# Altium schematic sheet MAZ000162 - Diagrama eléctrico.SchDoc: MAZ000162 - Diagrama eléctrico
size A; ApprovedBy: Christian Ledwidth; CheckedBy: Nahuel Martinez; Author: Santiago Marti; CompanyName: Body Health; DrawnBy: Santiago Marti; Revision: A; SheetNumber: 1; SheetTotal: 2
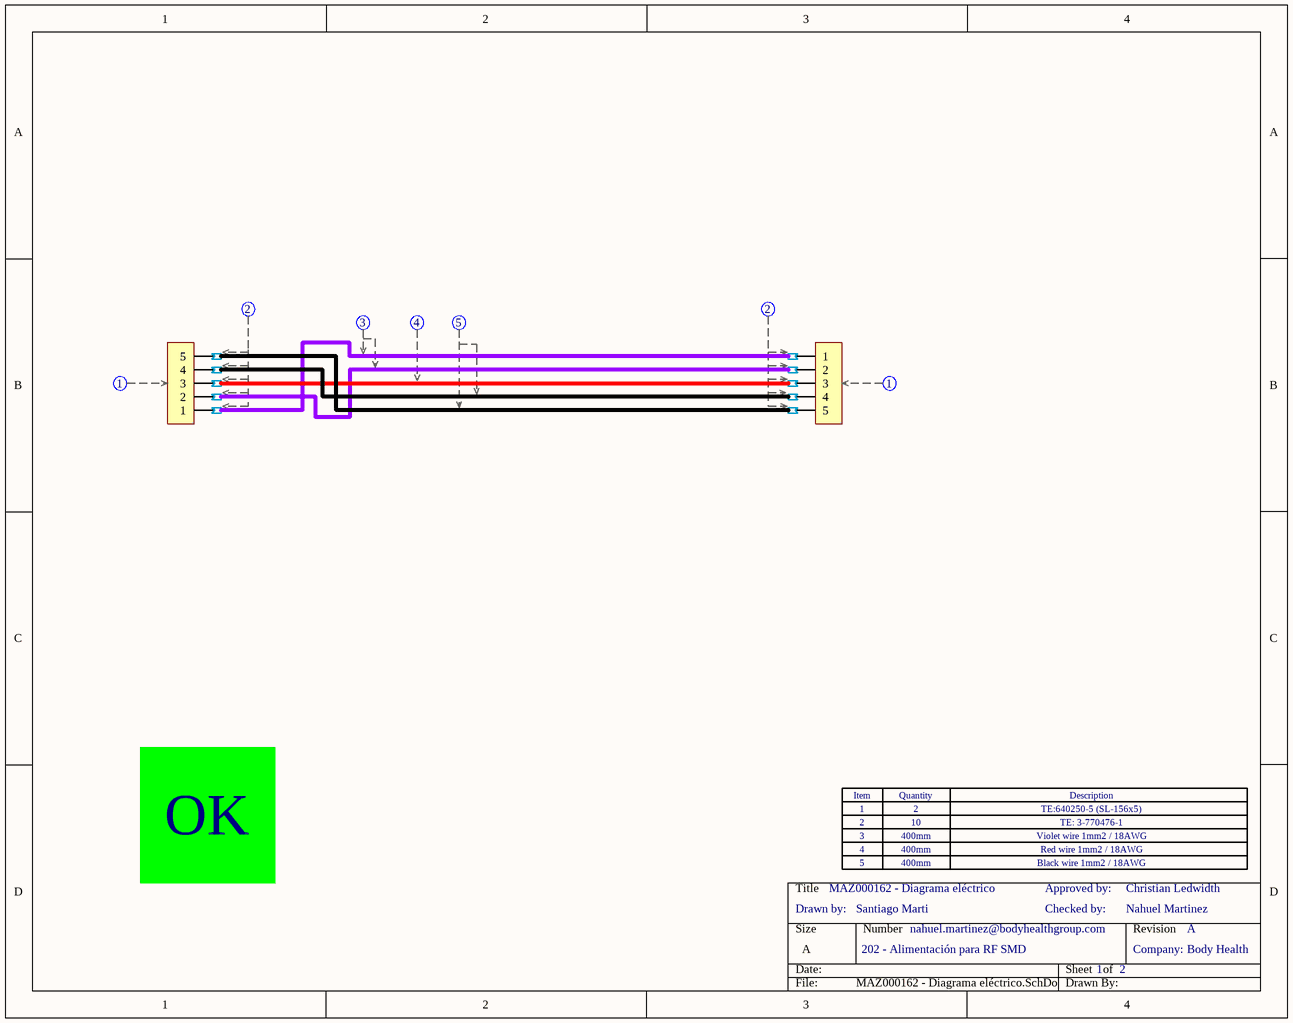
[diagram p0: MAZ000162 - Diagrama eléctrico.SchDoc]

## Parts
Con1  SL156-5  (value not drawn)  (parts C,D of 4)
Con2  SL156-5  (value not drawn)  (parts C,D of 4)
Soc1  sock_SL156_770476-1  (value not drawn)  (parts A,B of 2)
Soc2  sock_SL156_770476-1  (value not drawn)  (parts A,B of 2)
Soc3  sock_SL156_770476-1  (value not drawn)  (parts A,B of 2)
Soc4  sock_SL156_770476-1  (value not drawn)  (parts A,B of 2)
Soc5  sock_SL156_770476-1  (value not drawn)  (parts A,B of 2)
Soc6  sock_SL156_770476-1  (value not drawn)  (part B of 2)
Soc7  sock_SL156_770476-1  (value not drawn)  (part B of 2)
Soc8  sock_SL156_770476-1  (value not drawn)  (part B of 2)
Soc9  sock_SL156_770476-1  (value not drawn)  (part B of 2)
Soc10  sock_SL156_770476-1  (value not drawn)  (part B of 2)
Zoc1  Zócalo_Header  (value not drawn)
Zoc2  Zócalo_Item  (value not drawn)
Zoc3  Zócalo_Item  (value not drawn)
Zoc4  Zócalo_Item  (value not drawn)
Zoc5  Zócalo_Item  (value not drawn)
Zoc6  Zócalo_Item  (value not drawn)

## Nets
NetCon1_1: Con1.1 Soc9.0
NetCon1_2: Con1.2 Soc7.0
NetCon1_3: Con1.3 Soc5.0
NetCon1_4: Con1.4 Soc3.0
NetCon1_5: Con1.5 Soc1.0
NetCon2_1: Con2.1 Soc2.0
NetCon2_2: Con2.2 Soc4.0
NetCon2_3: Con2.3 Soc6.0
NetCon2_4: Con2.4 Soc8.0
NetCon2_5: Con2.5 Soc10.0
NetSoc1_1: Soc1.1 Soc10.1
NetSoc2_1: Soc2.1 Soc9.1
NetSoc3_1: Soc3.1 Soc8.1
NetSoc4_1: Soc4.1 Soc7.1
NetSoc5_1: Soc5.1 Soc6.1

## Notes on the sheet
- OK
- 1
- 2
- 3
- 10
- 400mm
- TE:640250-5 (SL-156x5)
- TE: 3-770476-1
- Violet wire 1mm2 / 18AWG
- Drawn by:
- 4
- 5
- Checked by:
- Approved by:
- Red wire 1mm2 / 18AWG
- Black wire 1mm2 / 18AWG
- 202 - Alimentación para RF SMD
- nahuel.martinez@bodyhealthgroup.com
- Company:
- (in symbol Zócalo_Header) Item; Quantity; Description

## Library data of the parts
Con1 Con2 = SL156-5: CONN RECEPT 5 POS W/RAMP SL-156; Cod.Fabricante: 640250-5; Fabricante: TE Connectivity AMP Connectors; CallOut: 1; Cod.DigiKey: A19953-ND; ComponentLink1Description: Manufacturer Link; ComponentLink1URL: https://www.te.com/commerce/DocumentDelivery/DDEController?Action=srchrtrv&DocNm=640250&DocType=Customer+Drawing&DocLang=English; DIGIKEYx50: 0.19420; DIGIKEYx100: 0.18660
Soc1 Soc5 = sock_SL156_770476-1: CONN SOCKET 18-24AWG CRIMP TIN; Fabricante: TE Connectivity AMP Connectors; CallOut: 2; Cod.DigiKey: A19993CT-ND; Cod.Fabricante: 770476-1; ComponentLink1Description: Manufacturer Link; ComponentLink1URL: https://www.te.com/commerce/DocumentDelivery/DDEController?Action=srchrtrv&DocNm=770476&DocType=Customer+Drawing&DocLang=English; DIGIKEYx100: 0.08690; DIGIKEYx50: 0.08180
Soc2 = sock_SL156_770476-1: CONN SOCKET 18-24AWG CRIMP TIN; Fabricante: TE Connectivity AMP Connectors; CallOut: 4; Cod.DigiKey: A19993CT-ND; Cod.Fabricante: 770476-1; ComponentLink1Description: Manufacturer Link; ComponentLink1URL: https://www.te.com/commerce/DocumentDelivery/DDEController?Action=srchrtrv&DocNm=770476&DocType=Customer+Drawing&DocLang=English; DIGIKEYx100: 0.08690; DIGIKEYx50: 0.08180
Soc3 = sock_SL156_770476-1: CONN SOCKET 18-24AWG CRIMP TIN; Fabricante: TE Connectivity AMP Connectors; CallOut: 3; Cod.DigiKey: A19993CT-ND; Cod.Fabricante: 770476-1; ComponentLink1Description: Manufacturer Link; ComponentLink1URL: https://www.te.com/commerce/DocumentDelivery/DDEController?Action=srchrtrv&DocNm=770476&DocType=Customer+Drawing&DocLang=English; DIGIKEYx100: 0.08690; DIGIKEYx50: 0.08180
Soc4 = sock_SL156_770476-1: CONN SOCKET 18-24AWG CRIMP TIN; Fabricante: TE Connectivity AMP Connectors; CallOut: 5; Cod.DigiKey: A19993CT-ND; Cod.Fabricante: 770476-1; ComponentLink1Description: Manufacturer Link; ComponentLink1URL: https://www.te.com/commerce/DocumentDelivery/DDEController?Action=srchrtrv&DocNm=770476&DocType=Customer+Drawing&DocLang=English; DIGIKEYx100: 0.08690; DIGIKEYx50: 0.08180
Soc6-Soc10 = sock_SL156_770476-1: CONN SOCKET 18-24AWG CRIMP TIN; Fabricante: TE Connectivity AMP Connectors; Cod.DigiKey: A19993CT-ND; Cod.Fabricante: 770476-1; ComponentLink1Description: Manufacturer Link; ComponentLink1URL: https://www.te.com/commerce/DocumentDelivery/DDEController?Action=srchrtrv&DocNm=770476&DocType=Customer+Drawing&DocLang=English; DIGIKEYx100: 0.08690; CallOut: *; DIGIKEYx50: 0.08180
Zoc1 = Zócalo_Header: Header para el zócalo de referencias
Zoc2-Zoc6 = Zócalo_Item: Ítem para el zócalo de referencias; Desginator: *; Quantity: *; ItemDescription: *